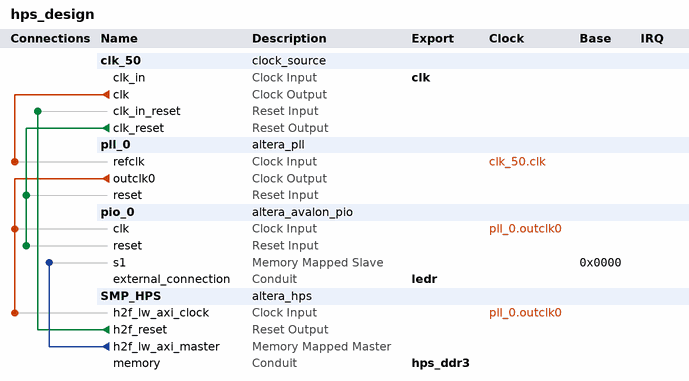
[diagram p0: system contents]
# Platform Designer (Qsys) system hps_design, Cyclone V 5CSEMA5F31C6
# Parameters at their usual value, and those the tool derives, are not listed.
package require -exact qsys 15.0
create_system hps_design
set_project_property DEVICE_FAMILY {Cyclone V}
set_project_property DEVICE 5CSEMA5F31C6

add_instance clk_50 clock_source 15.0
set_instance_parameter_value clk_50 clockFrequency 50000000

add_instance pll_0 altera_pll 15.0
set_instance_parameter_value pll_0 gui_device_speed_grade 2
set_instance_parameter_value pll_0 gui_number_of_clocks 1
set_instance_parameter_value pll_0 gui_operation_mode normal
set_instance_parameter_value pll_0 gui_output_clock_frequency0 100.0
set_instance_parameter_value pll_0 gui_pll_mode {Integer-N PLL}
set_instance_parameter_value pll_0 gui_reference_clock_frequency 50.0
set_instance_parameter_value pll_0 gui_use_locked false

add_instance pio_0 altera_avalon_pio 15.0
set_instance_parameter_value pio_0 direction Output
set_instance_parameter_value pio_0 width 1

add_instance SMP_HPS altera_hps 15.0
set_instance_parameter_value SMP_HPS EMAC1_Mode N/A
set_instance_parameter_value SMP_HPS EMAC1_PinMuxing Unused
set_instance_parameter_value SMP_HPS F2SCLK_COLDRST_Enable false
set_instance_parameter_value SMP_HPS F2SCLK_DBGRST_Enable false
set_instance_parameter_value SMP_HPS F2SCLK_WARMRST_Enable false
set_instance_parameter_value SMP_HPS F2SINTERRUPT_Enable false
set_instance_parameter_value SMP_HPS F2S_Width 0
set_instance_parameter_value SMP_HPS FPGA_PERIPHERAL_OUTPUT_CLOCK_FREQ_EMAC0_GTX_CLK 100
set_instance_parameter_value SMP_HPS FPGA_PERIPHERAL_OUTPUT_CLOCK_FREQ_EMAC0_MD_CLK 2.5
set_instance_parameter_value SMP_HPS FPGA_PERIPHERAL_OUTPUT_CLOCK_FREQ_EMAC1_GTX_CLK 100
set_instance_parameter_value SMP_HPS FPGA_PERIPHERAL_OUTPUT_CLOCK_FREQ_EMAC1_MD_CLK 2.5
set_instance_parameter_value SMP_HPS HPS_PROTOCOL DDR3
set_instance_parameter_value SMP_HPS I2C0_Mode N/A
set_instance_parameter_value SMP_HPS I2C0_PinMuxing Unused
set_instance_parameter_value SMP_HPS I2C1_Mode N/A
set_instance_parameter_value SMP_HPS I2C1_PinMuxing Unused
set_instance_parameter_value SMP_HPS LWH2F_Enable true
set_instance_parameter_value SMP_HPS MEM_BANKADDR_WIDTH 3
set_instance_parameter_value SMP_HPS MEM_CLK_FREQ 400.0
set_instance_parameter_value SMP_HPS MEM_COL_ADDR_WIDTH 10
set_instance_parameter_value SMP_HPS MEM_DQ_WIDTH 16
set_instance_parameter_value SMP_HPS MEM_DRV_STR RZQ/7
set_instance_parameter_value SMP_HPS MEM_ROW_ADDR_WIDTH 15
set_instance_parameter_value SMP_HPS MEM_RTT_NOM RZQ/4
set_instance_parameter_value SMP_HPS MEM_RTT_WR RZQ/4
set_instance_parameter_value SMP_HPS MEM_TCL 11
set_instance_parameter_value SMP_HPS MEM_TFAW_NS 30.0
set_instance_parameter_value SMP_HPS MEM_TRAS_NS 35.0
set_instance_parameter_value SMP_HPS MEM_TRCD_NS 13.75
set_instance_parameter_value SMP_HPS MEM_TRFC_NS 260.0
set_instance_parameter_value SMP_HPS MEM_TRP_NS 13.75
set_instance_parameter_value SMP_HPS MEM_VENDOR Other
set_instance_parameter_value SMP_HPS MEM_WTCL 8
set_instance_parameter_value SMP_HPS QSPI_Mode N/A
set_instance_parameter_value SMP_HPS QSPI_PinMuxing Unused
set_instance_parameter_value SMP_HPS REF_CLK_FREQ 25.0
set_instance_parameter_value SMP_HPS S2F_Width 0
set_instance_parameter_value SMP_HPS SDIO_Mode N/A
set_instance_parameter_value SMP_HPS SDIO_PinMuxing Unused
set_instance_parameter_value SMP_HPS SPIM1_Mode N/A
set_instance_parameter_value SMP_HPS SPIM1_PinMuxing Unused
set_instance_parameter_value SMP_HPS STM_Enable false
set_instance_parameter_value SMP_HPS TIMING_BOARD_AC_SKEW 0.02
set_instance_parameter_value SMP_HPS TIMING_BOARD_AC_TO_CK_SKEW 0.01
set_instance_parameter_value SMP_HPS TIMING_BOARD_DQ_TO_DQS_SKEW 0.05
set_instance_parameter_value SMP_HPS TIMING_BOARD_MAX_CK_DELAY 0.03
set_instance_parameter_value SMP_HPS TIMING_BOARD_MAX_DQS_DELAY 0.02
set_instance_parameter_value SMP_HPS TIMING_BOARD_SKEW_BETWEEN_DQS 0.06
set_instance_parameter_value SMP_HPS TIMING_BOARD_SKEW_CKDQS_DIMM_MAX 0.12
set_instance_parameter_value SMP_HPS TIMING_BOARD_SKEW_CKDQS_DIMM_MIN 0.06
set_instance_parameter_value SMP_HPS TIMING_BOARD_SKEW_WITHIN_DQS 0.01
set_instance_parameter_value SMP_HPS TIMING_TDH 65
set_instance_parameter_value SMP_HPS TIMING_TDQSCK 255
set_instance_parameter_value SMP_HPS TIMING_TDQSQ 125
set_instance_parameter_value SMP_HPS TIMING_TDS 30
set_instance_parameter_value SMP_HPS TIMING_TIH 140
set_instance_parameter_value SMP_HPS TIMING_TIS 180
set_instance_parameter_value SMP_HPS TIMING_TQSH 0.4
set_instance_parameter_value SMP_HPS UART0_Mode N/A
set_instance_parameter_value SMP_HPS UART0_PinMuxing Unused
set_instance_parameter_value SMP_HPS USB1_Mode N/A
set_instance_parameter_value SMP_HPS USB1_PinMuxing Unused
set_instance_parameter_value SMP_HPS desired_cfg_clk_mhz 100.0
set_instance_parameter_value SMP_HPS desired_qspi_clk_mhz 400.0

# connections
add_connection clk_50.clk pll_0.refclk clock
add_connection pll_0.outclk0 pio_0.clk clock
add_connection pll_0.outclk0 SMP_HPS.h2f_lw_axi_clock clock
add_connection clk_50.clk_reset pio_0.reset reset
add_connection clk_50.clk_reset pll_0.reset reset
add_connection SMP_HPS.h2f_reset clk_50.clk_in_reset reset
add_connection SMP_HPS.h2f_lw_axi_master pio_0.s1 avalon
set_connection_parameter_value SMP_HPS.h2f_lw_axi_master/pio_0.s1 baseAddress 0x0000

# exported interfaces
add_interface clk clock sink
set_interface_property clk EXPORT_OF clk_50.clk_in
add_interface hps_ddr3 conduit end
set_interface_property hps_ddr3 EXPORT_OF SMP_HPS.memory
add_interface ledr conduit end
set_interface_property ledr EXPORT_OF pio_0.external_connection

set_interconnect_requirement {$system} qsys_mm.clockCrossingAdapter HANDSHAKE
set_interconnect_requirement {$system} qsys_mm.insertDefaultSlave FALSE
set_interconnect_requirement {$system} qsys_mm.maxAdditionalLatency 1

save_system hps_design.qsys
